# Altium schematic sheet RM_LM25116.SchDoc
size A3 portrait
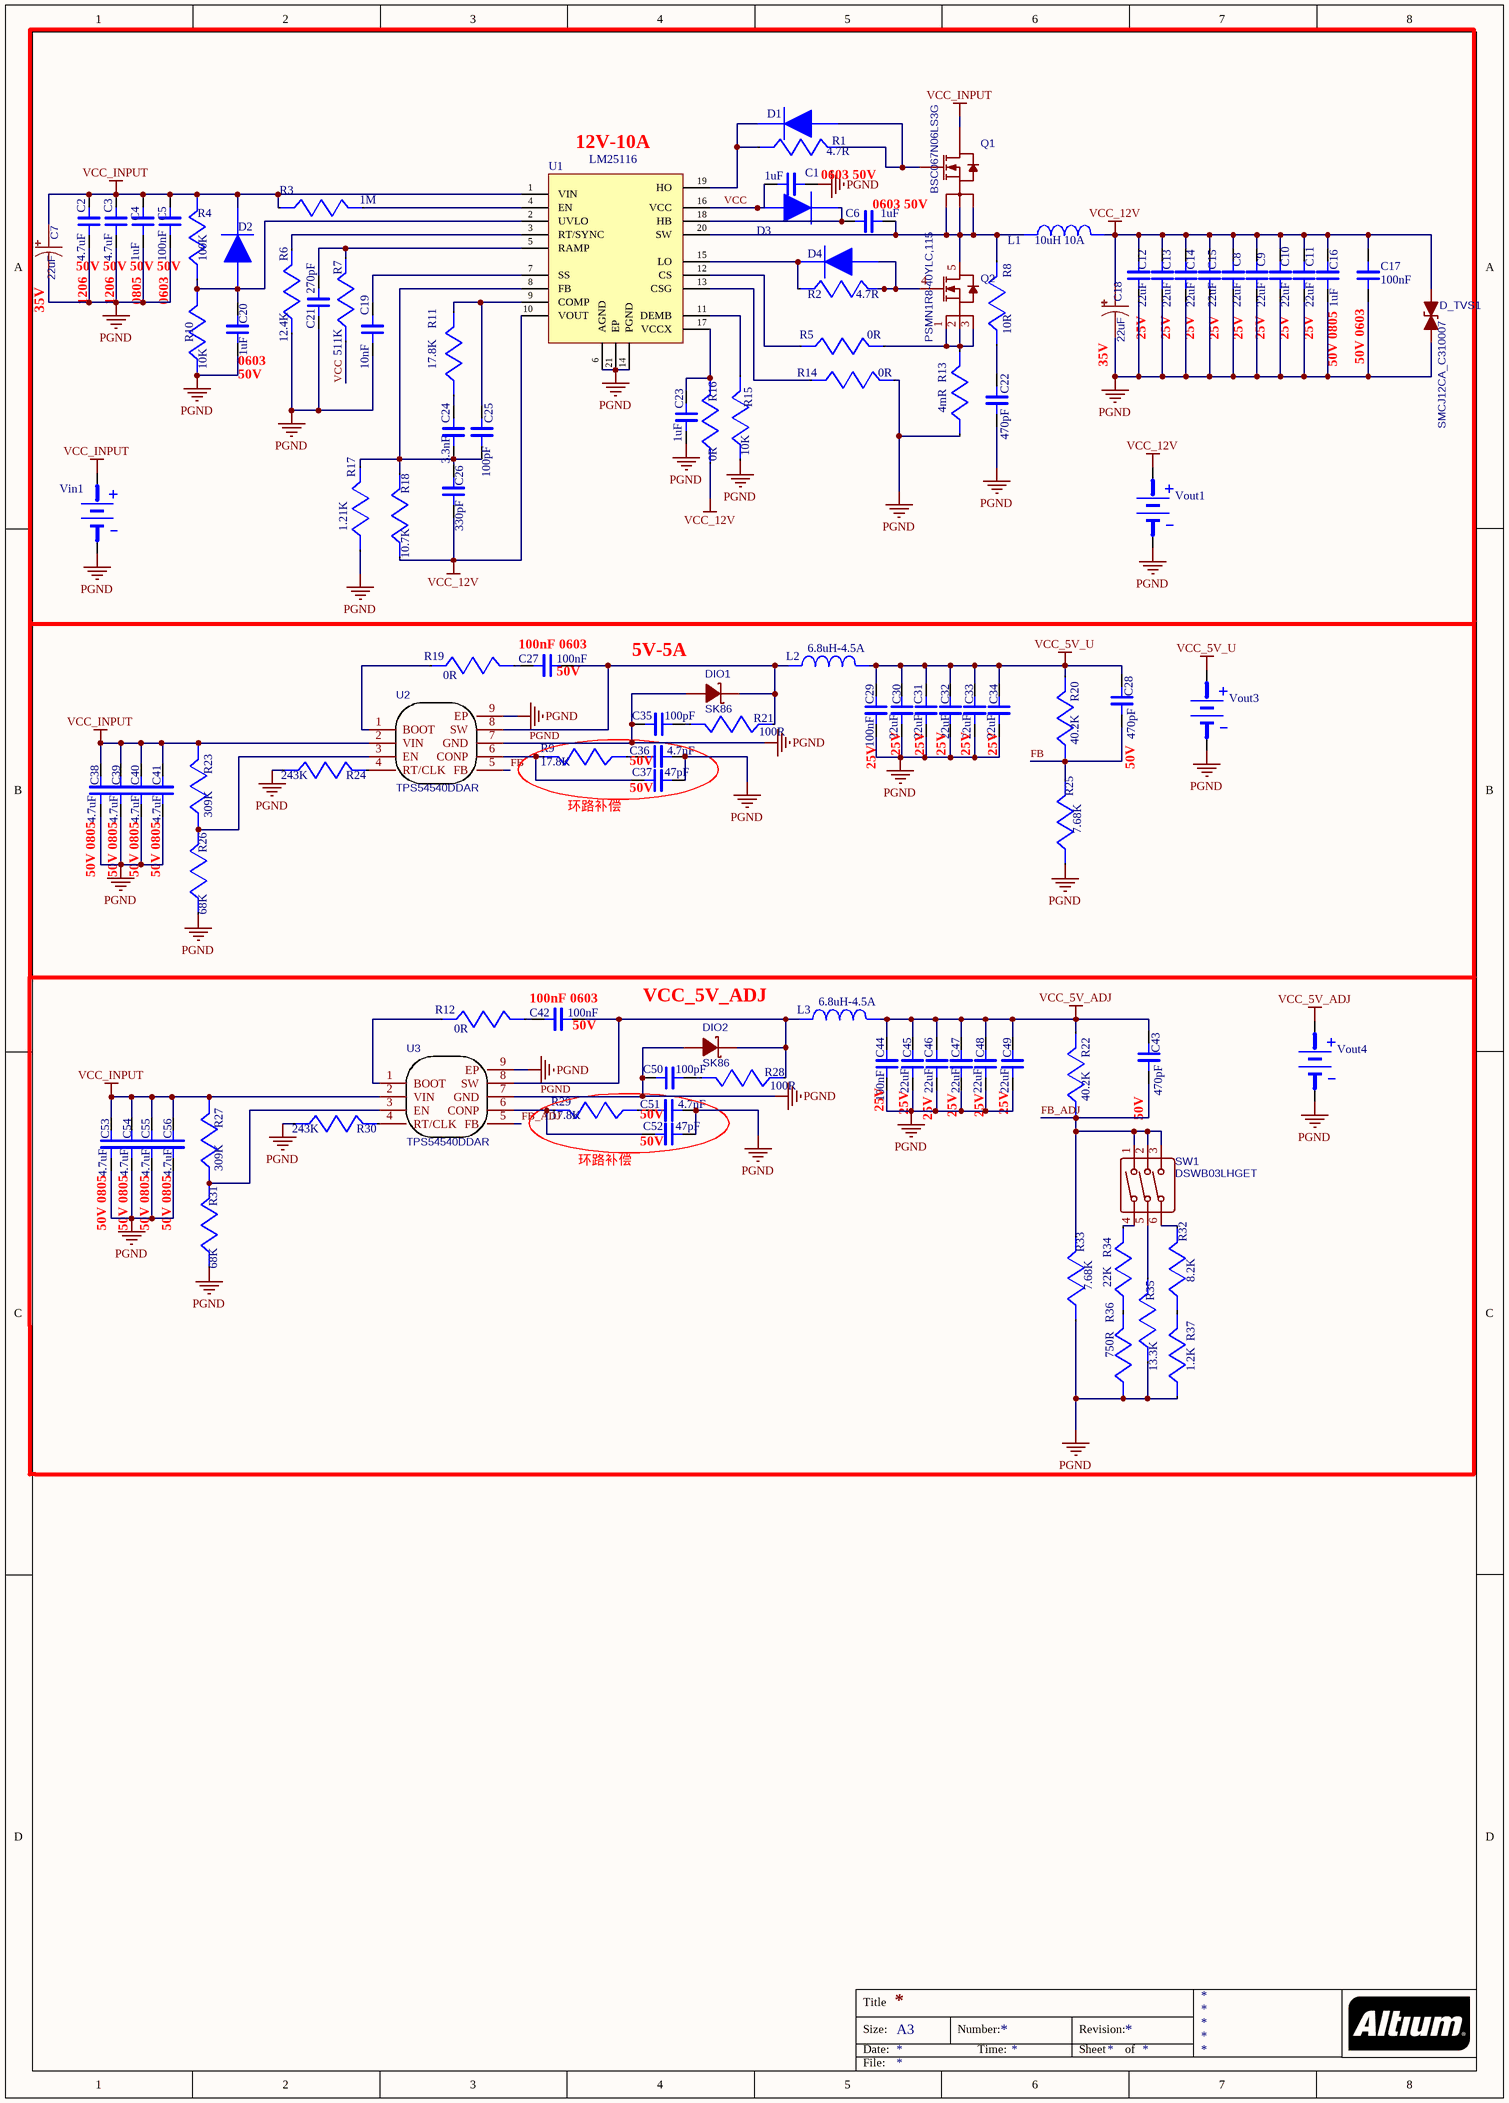
[diagram p0: RM_LM25116.SchDoc]

## Parts
C1  1uF  [0603P]
C2  4.7uF  [1206]
C3  4.7uF  [1206]
C4  1uF  [0805]
C5  100nF  [0603P]
C6  1uF  [0603P]
C7  22uF  [22uF]
C8  22uF  [0603P]
C9  22uF  [0603P]
C10  22uF  [0603P]
C11  22uF  [0603P]
C12  22uF  [0603P]
C13  22uF  [0603P]
C14  22uF  [0603P]
C15  22uF  [0603P]
C16  1uF  [0805]
C17  100nF  [0603P]
C18  22uF  [22uF]
C19  10nF  [0603P]
C20  1uF  [0603P]
C21  270pF  [0603P]
C22  470pF  [0603P]
C23  1uF  [0603P]
C24  3.3nF  [0603P]
C25  100pF  [0603P]
C26  330pF  [0603P]
C27  100nF  [0603P]
C28  470pF  [0603P]
C29  100nF  [0603P]
C30  22uF  [0603P]
C31  22uF  [0603P]
C32  22uF  [0603P]
C33  22uF  [0603P]
C34  22uF  [0603P]
C35  100pF  [0603P]
C36  4.7nF  [0603P]
C37  47pF  [0603P]
C38  4.7uF  [0805]
C39  4.7uF  [0805]
C40  4.7uF  [0805]
C41  4.7uF  [0805]
C42  100nF  [0603P]
C43  470pF  [0603P]
C44  100nF  [0603P]
C45  22uF  [0603P]
C46  22uF  [0603P]
C47  22uF  [0603P]
C48  22uF  [0603P]
C49  22uF  [0603P]
C50  100pF  [0603P]
C51  4.7nF  [0603P]
C52  47pF  [0603P]
C53  4.7uF  [0805]
C54  4.7uF  [0805]
C55  4.7uF  [0805]
C56  4.7uF  [0805]
D1  BAS516,115  [SOD-523]  (value not drawn)
D2  BAS516,115  [SOD-523]  (value not drawn)
D3  BAS516,115  [SOD-523]  (value not drawn)
D4  BAS516,115  [SOD-523]  (value not drawn)
D_TVS1  SMCJ12CA_C310007  [TVS]
DIO1  SK86  [SMC(DO-214AB)]
DIO2  SK86  [SMC(DO-214AB)]
L1  10uH 10A  [10uH 10A]
L2  6.8uH-4.5A  [6.8uH 4.5A]
L3  6.8uH-4.5A  [6.8uH 4.5A]
Q1  BSC067N06LS3G  [BSC067N06LS3G]
Q2  PSMN1R8-40YLC,115  [PSMN1R8-40YLC,115]
R1  4.7R  [0603P]
R2  4.7R  [0603P]
R3  1M  [0603P]
R4  100K  [0603P]
R5  0R  [0603P]
R6  12.4K  [0603P]
R7  511K  [0603P]
R8  10R  [0603P]
R9  17.8K  [0603P]
R10  10K  [0603P]
R11  17.8K  [0603P]
R12  0R  [0603P]
R13  4mR  [LC-2512_L]
R14  0R  [0603P]
R15  10K  [0603P]
R16  0R  [0603P]
R17  1.21K  [0603P]
R18  10.7K  [0603P]
R19  0R  [0603P]
R20  40.2K  [0603P]
R21  100R  [0603P]
R22  40.2K  [0603P]
R23  309K  [0603P]
R24  243K  [0603P]
R25  7.68K  [0603P]
R26  68K  [0603P]
R27  309K  [0603P]
R28  100R  [0603P]
R29  17.8K  [0603P]
R30  243K  [0603P]
R31  68K  [0603P]
R32  8.2K  [0603P]
R33  7.68K  [0603P]
R34  22K  [0603P]
R35  13.3K  [0603P]
R36  750R  [0603P]
R37  1.2K  [0603P]
SW1  DSWB03LHGET  [CH3_SWITCH]
U1  LM25116  [MXA20A]
U2  TPS54540DDAR  [TPS54540]
U3  TPS54540DDAR  [TPS54540]
Vin1  WB_BATTERY  [XT30_PW母头]  (value not drawn)
Vout1  Vout  [XT30_PW公头]  (value not drawn)
Vout3  Vout  [XT30_PW公头]  (value not drawn)
Vout4  Vout  [XT30_PW公头]  (value not drawn)

## Nets
PGND: C1.2 C2.1 C3.1 C4.1 C5.1 C7.2 C8.1 C9.1 C10.1 C11.1 C12.1 C13.1 C14.1 C15.1 C16.1 C17.1 C18.2 C19.1 C20.1 C21.1 C22.1 C23.1 C29.1 C30.1 C31.1 C32.1 C33.1 C34.1 C35.2 C36.2 C37.2 C38.1 C39.1 C40.1 C41.1 C44.1 C45.1 C46.1 C47.1 C48.1 C49.1 C50.2 C51.2 C52.2 C53.1 C54.1 C55.1 C56.1 D_TVS1.1(K) DIO1.1(A) DIO2.1(A) R6.1 R10.1 R13.1 R14.2 R15.1 R17.1 R24.1 R25.1 R26.1 R30.1 R31.1 R33.1 R35.1 R36.1 R37.1 U1.6(AGND) U1.14(PGND) U1.21(EP) U2.7(GND) U2.9(EP) U3.7(GND) U3.9(EP) Vin1.2(-) Vout1.2(-) Vout3.2(-) Vout4.2(-)
VCC_5V_ADJ: C43.2 C44.2 C45.2 C46.2 C47.2 C48.2 C49.2 L3.2 R22.2 Vout4.1(+)
VCC_5V_U: C28.2 C29.2 C30.2 C31.2 C32.2 C33.2 C34.2 L2.2 R20.2 Vout3.1(+)
VCC_12V: C8.2 C9.2 C10.2 C11.2 C12.2 C13.2 C14.2 C15.2 C16.2 C17.2 C18.1 C26.1 D_TVS1.2(A) L1.2 R16.1 R18.1 U1.10(VOUT) Vout1.1(+)
VCC_INPUT: C2.2 C3.2 C4.2 C5.2 C7.1 C38.2 C39.2 C40.2 C41.2 C53.2 C54.2 C55.2 C56.2 D2.1(K) Q1.5(D) R3.1 R4.2 R23.2 R27.2 U1.1(VIN) U2.2(VIN) U3.2(VIN) Vin1.1(+)
FB: C28.1 R20.1 R25.2 U2.5(FB)
FB_ADJ: C43.1 R22.1 R33.2 SW1.1 SW1.2 SW1.3 U3.5(FB)
VCC: C1.1 D3.2(A) R7.1 U1.16(VCC)
NetC6_1: C6.1 D3.1(K) U1.18(HB)
NetC6_2: C6.2 L1.1 Q1.1(S) Q1.2(S) Q1.3(S) Q2.5(D) R8.2 U1.20(SW)
NetC19_2: C19.2 U1.7(SS)
NetC20_2: C20.2 D2.2(A) R4.1 R10.2 U1.2(UVLO)
NetC21_2: C21.2 R7.2 U1.5(RAMP)
NetC22_2: C22.2 R8.1
NetC23_2: C23.2 R16.2 U1.17(VCCX)
NetC24_1: C24.1 R11.1
NetC24_2: C24.2 C25.2 C26.2 R17.2 R18.2 U1.8(FB)
NetC25_1: C25.1 R11.2 U1.9(COMP)
NetC27_1: C27.1 R19.2
NetC27_2: C27.2 DIO1.2(K) L2.1 R21.1 U2.8(SW)
NetC35_1: C35.1 R21.2
NetC36_1: C36.1 R9.1
NetC37_1: C37.1 R9.2 U2.6(CONP)
NetC42_1: C42.1 R12.2
NetC42_2: C42.2 DIO2.2(K) L3.1 R28.1 U3.8(SW)
NetC50_1: C50.1 R28.2
NetC51_1: C51.1 R29.1
NetC52_1: C52.1 R29.2 U3.6(CONP)
NetD1_1: D1.1(K) R1.1 U1.19(HO)
NetD1_2: D1.2(A) Q1.4(G) R1.2
NetD4_1: D4.1(K) R2.1 U1.15(LO)
NetD4_2: D4.2(A) Q2.4(G) R2.2
NetQ2_1: Q2.1(S) Q2.2(S) Q2.3(S) R5.2 R13.2
NetR3_2: R3.2 U1.4(EN)
NetR5_1: R5.1 U1.12(CS)
NetR6_2: R6.2 U1.3(RT/SYNC)
NetR12_1: R12.1 U3.1(BOOT)
NetR14_1: R14.1 U1.13(CSG)
NetR15_2: R15.2 U1.11(DEMB)
NetR19_1: R19.1 U2.1(BOOT)
NetR23_1: R23.1 R26.2 U2.3(EN)
NetR24_2: R24.2 U2.4(RT/CLK)
NetR27_1: R27.1 R31.2 U3.3(EN)
NetR30_2: R30.2 U3.4(RT/CLK)
NetR32_1: R32.1 R37.2
NetR32_2: R32.2 SW1.6
NetR34_1: R34.1 R36.2
NetR34_2: R34.2 SW1.4
NetR35_2: R35.2 SW1.5

## Notes on the sheet
- (near U1) 12V-10A
- 0603 50V
- 50V
- 1206
- 0805
- 0603
- (near C7) 35V
- (near C20) 0603
- (near C18) 35V
- 25V
- 50V 0805
- 50V 0603
- (near C27) 100nF 0603
- (near C27) 50V
- 5V-5A
- (near C36) 50V
- (near C28) 50V
- 环路补偿
- (near C37) 50V
- (near C42) 100nF 0603
- (near C42) 50V
- (near DIO2) VCC_5V_ADJ
- (near C44) 25V
- (near C52) 50V
- (near C51) 50V
- Title
- Size:
- Date:
- A3
- Number:
- Time:
- Revision:
- Sheet
- of
- File:

## Library data of the parts
C1-C6 C8-C17 C19-C56 = CAP: Capacitor
C7 C18 = 22uF: BOM_Manufacturer: TORCH; BOM_Manufacturer Part: CA45-D-35V-22μF-K; nameAlias: Capacitance; Contributor: LCSC; SMT Type: Extend; BOM_Supplier: LCSC; BOM_Supplier Part: C171667; BOM_LCSC Assembly: Yes; spicePre: C; spiceSymbolName: CA45-D-35V-22μF-K
D1-D4 = D1: Manufacturer Name: Nexperia; PackageReference: BAS516,115; Manufacturer Part Number: BAS516,115
D_TVS1 = SMCJ12CA_C310007: BOM_Manufacturer: Brightking Elec (TAIWAN); Contributor: LCSC; BOM_Supplier: LCSC; BOM_Supplier Part: C310007; BOM_Manufacturer Part: SMCJ12CA; spicePre: D
DIO1 DIO2 = SK86: BOM_Manufacturer: MDD; SMT Type: Extend; BOM_Supplier: LCSC; BOM_Manufacturer Part: SK86; image: //image.lceda.cn/szlcsc/C64338.jpg; BOM_Supplier Part: C64338; BOM_LCSC Assembly: Yes; spicePre: D
L1-L3 = L1: Unknown; Manufacturer Part Number: MLC1565-372MLB; Manufacturer Name: Coilcraft; PackageReference: MLC1565-372MLB
Q1 = BSC067N06LS3G: BOM_Manufacturer: Infineon; BOM_Supplier: LCSC; BOM_Manufacturer Part: BSC067N06LS3G; image: //image.lceda.cn/szlcsc/C24199.jpg; BOM_Supplier Part: C24199; spicePre: Q
Q2 = PSMN1R8-40YLC,115: BOM_Manufacturer: Nexperia; BOM_Supplier: LCSC; BOM_Manufacturer Part: PSMN1R8-40YLC,115; BOM_Supplier Part: C88071; spicePre: Q
R1-R31 R33 = RES: RES?
R32 R34 R35 R37 = RES: R
R36 = RES
SW1 = DSWB03LHGET: BOM_Manufacturer: Dongguan Guangzhu Industrial; Contributor: LCSC; BOM_Supplier: LCSC; BOM_Supplier Part: C99420; BOM_Manufacturer Part: -; spicePre: S
U2 U3 = TPS54540DDAR: BOM_Manufacturer: TI; SMT Type: Extend; BOM_Supplier: LCSC; BOM_Manufacturer Part: TPS54540DDAR; BOM_Supplier Part: C95286; BOM_LCSC Assembly: Yes; spicePre: U
Vin1 = Vin: PackageReference: WB_BATTERY; Manufacturer Part Number: WB_BATTERY; Manufacturer Name: WB_BATTERY; Value: N/A
Vout1 Vout3 Vout4 = Vout: BATTERY; Manufacturer Part Number: WB_BATTERY; PackageReference: WB_BATTERY; Manufacturer Name: WB_BATTERY; Value: N/A